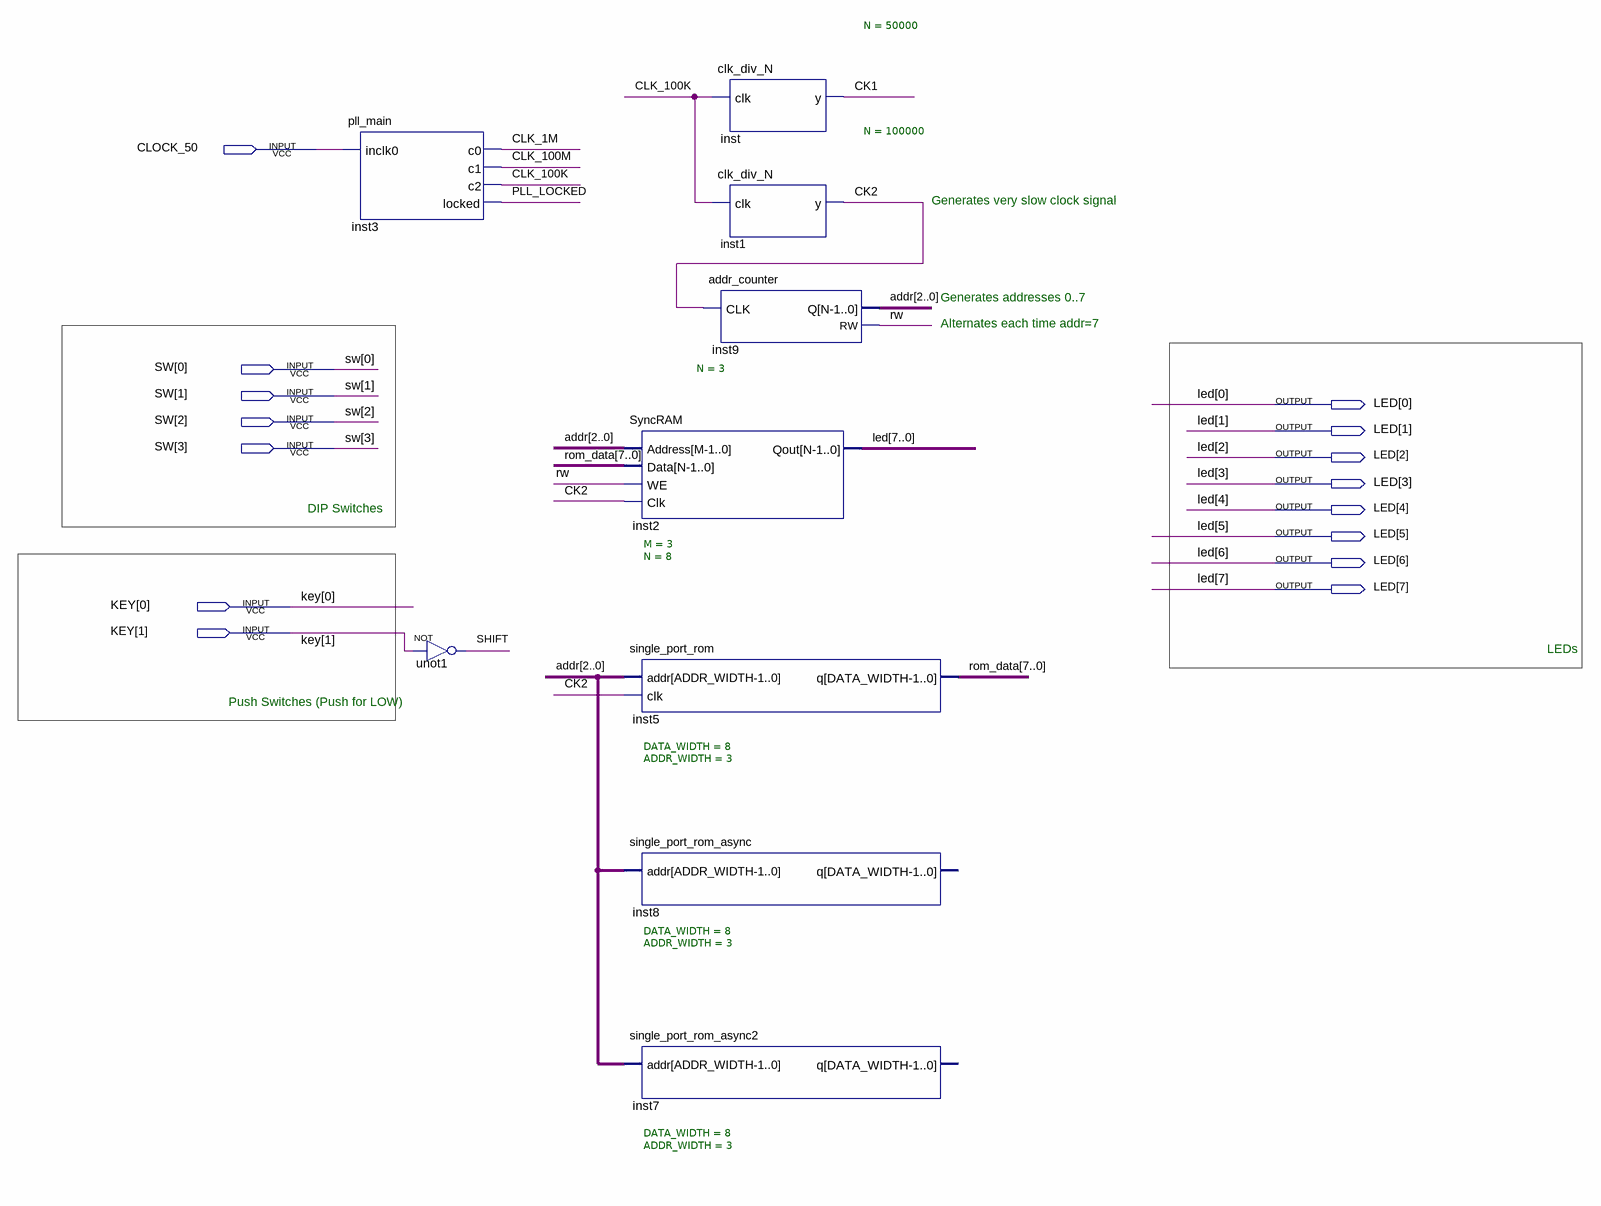
[diagram p0: schematic sheet]
// Quartus schematic TopLevelSchematic.bdf as structural Verilog: 9 symbols, 15 pins
module TopLevelSchematic (
  input  CLOCK_50,
  input  [3:0] SW,
  input  [1:0] KEY,
  output [7:0] LED
);

  wire CK1, CK2, CLK_1M, CLK_100K, CLK_100M, PLL_LOCKED, rw, SHIFT;
  wire [2:0] addr;
  wire [7:0] rom_data;

  pll_main inst3 (.inclk0(CLOCK_50), .c0(CLK_1M), .c1(CLK_100M), .c2(CLK_100K), .locked(PLL_LOCKED));
  not unot1 (SHIFT, KEY[1]);
  SyncRAM #(.M(3), .N(8)) inst2 (.Address(addr), .Data(rom_data), .WE(rw), .Clk(CK2), .Qout(LED));
  single_port_rom #(.DATA_WIDTH(8), .ADDR_WIDTH(3)) inst5 (.addr(addr), .clk(CK2), .q(rom_data));
  single_port_rom_async #(.DATA_WIDTH(8), .ADDR_WIDTH(3)) inst8 (.addr(addr));  // open: q
  single_port_rom_async2 #(.DATA_WIDTH(8), .ADDR_WIDTH(3)) inst7 (.addr(addr));  // open: q
  clk_div_N #(.N(50000)) inst (.clk(CLK_100K), .y(CK1));
  clk_div_N #(.N(100000)) inst1 (.clk(CLK_100K), .y(CK2));
  addr_counter #(.N(3)) inst9 (.CLK(CK2), .Q(addr), .RW(rw));

  // Notes on the sheet:
  //   Generates very slow clock signal
  //   Generates addresses 0..7
  //   Alternates each time addr=7
  //   DIP Switches
  //   LEDs
  //   Push Switches (Push for LOW)
endmodule
